# EAGLE design htr_reg (EAGLE 9.0.1)
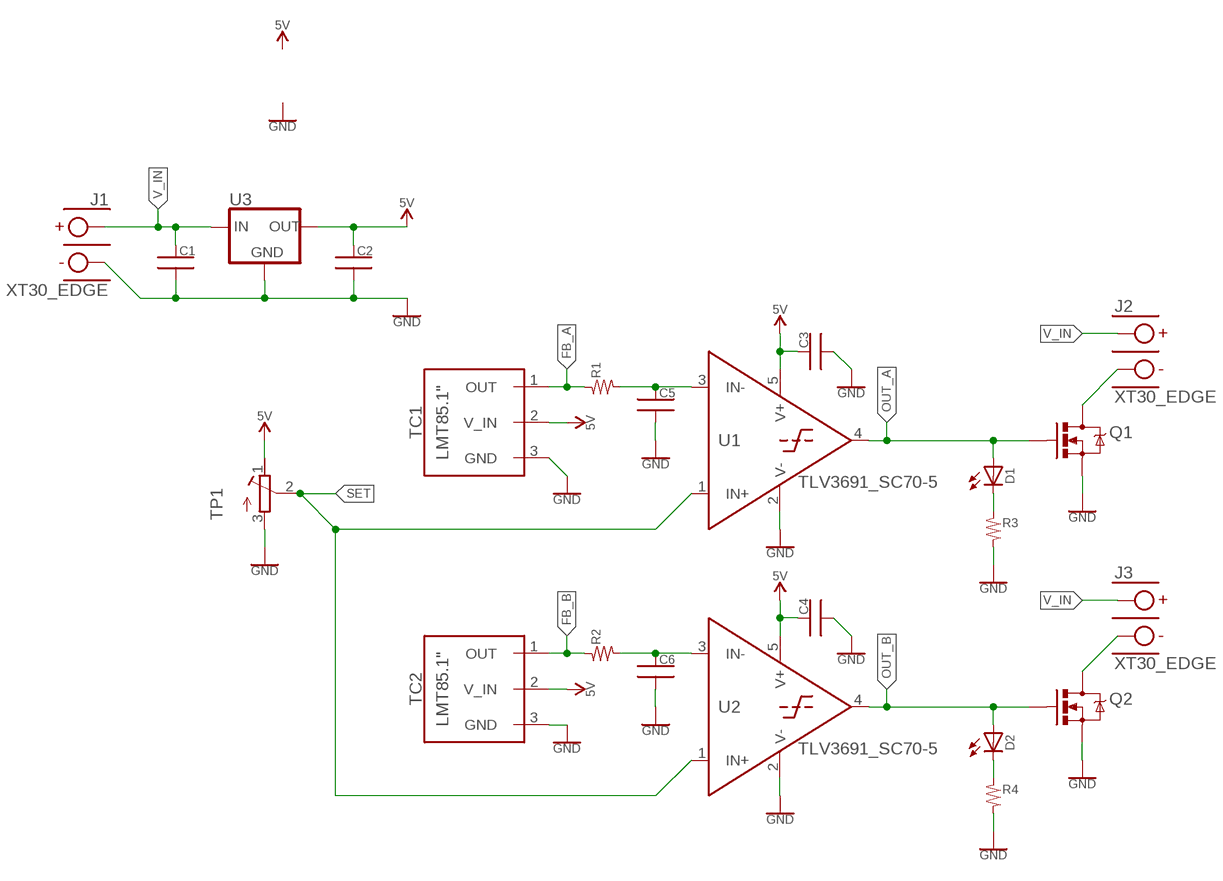
[diagram p0: schematic, sheet 1]

## Parts
C1  CAP_SMD_0603  [0603]
C2  CAP_SMD_0603  [0603]
C3  CAP_SMD_0603  [0603]
C4  CAP_SMD_0603  [0603]
C5  CAP_SMD_0603  [0603]
C6  CAP_SMD_0603  [0603]
D1  LED0603  [LED-0603]
D2  LED0603  [LED-0603]
J1  XT30_EDGE  [XT30_EDGEMOUNT]
J2  XT30_EDGE  [XT30_EDGEMOUNT]
J3  XT30_EDGE  [XT30_EDGEMOUNT]
Q1  MOSFET_N-CHANNEL_SOT23-3  [SOT23-3]
Q2  MOSFET_N-CHANNEL_SOT23-3  [SOT23-3]
R1  RES_SMD0603  [0603]
R2  RES_SMD0603  [0603]
R3  RES_SMD0603  [0603]
R4  RES_SMD0603  [0603]
TC1  LMT85.1"  [1X03]
TC2  LMT85.1"  [1X03]
TP1  3296W  [3296W]
U1  TLV3691_SC70-5  [SC70-5]
U2  TLV3691_SC70-5  [SC70-5]
U3  78XX_VREG_B  [SOT23-3]

## Nets
5V: C2.1 C3.1 C4.1 TC1.2(V_IN) TC2.2(V_IN) TP1.1(E) U1.5(V+) U2.5(V+) U3.2(OUT)
FB_A: R1.1 TC1.1(OUT)
FB_B: R2.1 TC2.1(OUT)
GND: C1.2 C2.2 C3.2 C4.2 C5.2 C6.2 J1.NEG Q1.2(S) Q2.2(S) R3.2 R4.2 TC1.3(GND) TC2.3(GND) TP1.3(A) U1.2(V-) U2.2(V-) U3.1(GND)
N$2: D1.C R3.1
N$4: D2.C R4.1
N$5: J3.NEG Q2.3(D)
N$6: J2.NEG Q1.3(D)
N$7: C6.1 R2.2 U2.3(IN-)
N$9: C5.1 R1.2 U1.3(IN-)
OUT_A: D1.A Q1.1(G) U1.4(OUT)
OUT_B: D2.A Q2.1(G) U2.4(OUT)
SET: TP1.2(S) U1.1(IN+) U2.1(IN+)
V_IN: C1.1 J1.POS J2.POS J3.POS U3.3(IN)

## Library data of the parts
C1-C6 = htr_reg_lib:CAP_SMD
D1 D2 = htr_reg_lib:LED
J1-J3 = htr_reg_lib:XT30
Q1 Q2 = htr_reg_lib:MOSFET_N-CHANNEL
R1-R4 = htr_reg_lib:RES_SMD
TC1 TC2 = htr_reg_lib:LMT85: LMT85 Analog Temperature Sensor -50C to 150C, 1.8V-5.5V Vin Texas Instruments http://www.ti.com/lit/ds/symlink/lmt85.pdf
TP1 = htr_reg_lib:3296: Bourns Trimpot 3296
U1 U2 = htr_reg_lib:TLV3691: generic comparator, .9 to 6.5v, 24us response, pushpull output. http://www.ti.com/lit/ds/symlink/tlv3691.pdf
U3 = htr_reg_lib:78XX_VREG: Generic IGO 78XX linear voltage regulator

## Board
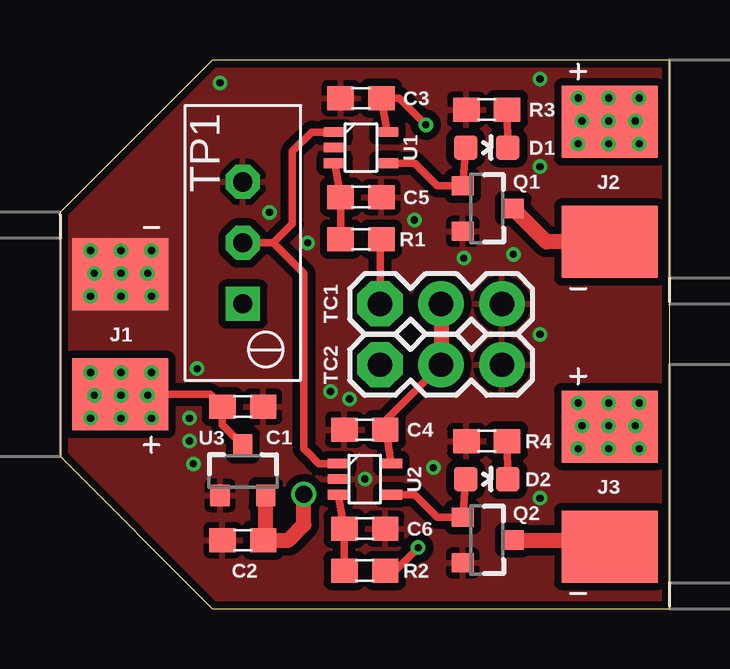
[diagram p1: board, top side]
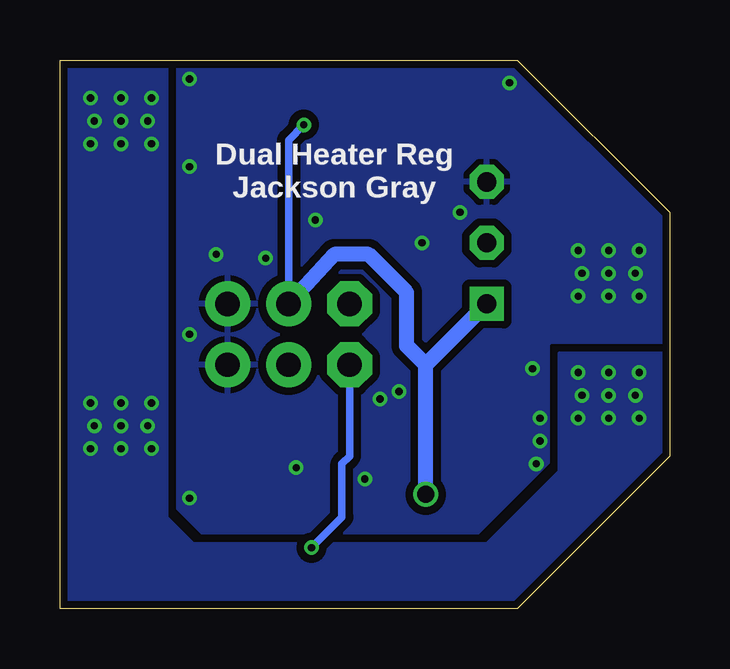
[diagram p2: board, bottom side, seen from below]

Size 25.4 x 22.86 mm. Coordinates in mm from the lower left corner, seen from the top.
Outline: 0,16.51 0,6.35 6.35,0 25.4,0 25.4,22.86 6.35,22.86 0,16.51
Copper layers (1*16): Top 0.035mm / dielectric 1.5mm / Bottom 0.035mm
Design rules "3PCB_2layer *": minimum track width 6mil, minimum drill 0.3mm, track to track 6mil, track to pad 6mil, pad to pad 6mil, via to via 6mil, smd to smd 6mil, copper to edge 6mil, drill to drill 6mil, minimum pad ring 6mil, minimum via ring 6mil, stop-mask expansion 2mil, vias tented up to drill 4mm, thermal gap 10mil

### Footprints (pad centres in the part's own frame; a part is rotated, then mirrored left to right if it is on the bottom)
0603 = smd 1.1 x 1: 1 -0.85,0; 2 0.85,0
LED-0603 = smd 1 x 1: A 0,-0.877; C 0,0.877
XT30_EDGEMOUNT = smd 4 x 3: NEG -2.5,-2.5; POS -2.5,2.5
SOT23-3 = smd 0.8 x 0.9: 1 -0.95,-1; 2 0.95,-1; 3 0,1.1
1X03 = drill 1.016 pad 1.88 octagon: 1 0,0 | drill 1.016 pad 1.88: 2 2.54,0; 3 5.08,0
3296W = drill 0.8 pad 1.422 square: 1 0,-2.54 | drill 0.8 pad 1.422 octagon: 2 0,0; 3 0,2.54
SC70-5 = smd 0.9 x 0.4: 1 -1.1,0.65; 2 -1.1,0; 3 -1.1,-0.65; 4 1.1,-0.65; 5 1.1,0.65

### Placement (x,y rotation side)
C1  7.62,8.41 0 top
C2  7.62,2.86 180 top
C3  12.54,21.27 180 top
C4  12.7,7.46 180 top
C5  12.54,17.14 0 top
C6  12.7,3.33 0 top
D1  17.78,19.21 270 top
D2  17.78,5.4 270 top
J1  0,11.43 180 top
J2  25.4,17.78 0 top
J3  25.4,5.08 0 top
Q1  17.78,16.67 270 top
Q2  17.78,2.86 270 top
R1  12.54,15.4 180 top
R2  12.7,1.59 180 top
R3  17.78,20.8 180 top
R4  17.78,6.99 180 top
TC1  13.34,12.7 0 top
TC2  13.34,10.16 0 top
TP1  7.62,15.24 0 top
U1  12.54,19.21 0 top
U2  12.7,5.4 0 top
U3  7.62,5.71 0 top

### Tracks (layer width: path | path; a pad name or v marks a point on that pad's centre or on a via)
5V  (via drill 0.3, 0.7)
  Top 0.318: C2.1 8.57,2.96 | TC2.2 13.55,7.83 13.55,7.62 | 13.55,7.62 C4.1 | U2.5 13.55,7.62 | U1.5 C3.1 14.13,21.27 v15.24,20.16
  Top 0.635: 8.57,2.96 U3.2 | TC1.2 TC2.2 | C2.1 9.53,2.86 10.16,3.49 v10.16,4.76
  Bottom 0.318: v15.24,20.16 15.88,19.53 TC1.2
  Bottom 0.635: 10.16,10.16 TP1.1 | v10.16,4.76 10.16,10.16 | 10.16,10.16 10.95,10.95 10.95,13.18 12.54,14.76 13.97,14.76 TC1.2
FB_A
  Top 0.318: TC1.1 13.34,14.92 R1.1
FB_B  (via drill 0.3)
  Top 0.318: v14.92,2.54 13.97,1.59 R2.1
  Bottom 0.318: v14.92,2.54 13.65,3.81 13.65,6.03 13.34,6.35 TC2.1
GND  (via drill 0.3)
  other vias: 10.32,15.24 8.73,16.51 14.76,16.19 16.83,14.61 11.27,9.05 12.06,8.73 5.4,7.94 5.71,10 5.56,6.03 5.4,6.99 1.27,14.92 1.27,13.02 2.54,13.02 3.81,13.02 3.81,14.92 2.54,14.92 2.54,13.97 1.43,13.97 3.65,13.97 6.67,21.91 15.56,5.87 12.7,5.4 20,22.07 20,18.41 18.89,14.76 20,11.43 20,4.6
  pour Top (isolate 0.318, rank 4): -2.54,-2.54 27.94,-2.54 27.94,25.4 -2.54,25.4
  pour Bottom (isolate 0.318, rank 4): -3.81,-3.81 29.21,-3.81 29.21,26.67 -3.81,26.67
N$2
  Top 0.318: R3.1 D1.C
N$4
  Top 0.318: R4.1 D2.C
N$5
  Top 0.635: Q2.3 22.62,2.86 J3.NEG
N$6
  Top 0.635: J2.NEG 20.27,15.28 Q1.3
N$7
  Top 0.318: R2.2 C6.1 U2.3
N$9
  Top 0.318: U1.3 C5.1 R1.2
OUT_A
  Top 0.318: D1.A Q1.1 15.72,17.62 14.78,18.56 U1.4
OUT_B
  Top 0.318: D2.A Q2.1 15.72,3.81 14.78,4.75 U2.4
SET
  Top 0.318: TP1.2 8.89,15.24 | 8.89,15.24 9.68,16.03 9.68,19.05 10.49,19.86 U1.1 | 8.89,15.24 10.16,13.97 10.16,6.67 10.32,6.51 10.78,6.05 U2.1
V_IN  (via drill 0.3)
  Top 0.152: J1.POS v1.27,9.84 | J3.POS v21.59,8.57 | J2.POS v21.59,21.27
  Top 0.318: J1.POS 6.25,8.93 C1.1 6.77,7.67 U3.3
  other vias: 22.86,20.32 24.13,6.67 2.54,8.89 1.43,8.89 1.27,7.94 2.54,7.94 3.81,7.94 3.81,9.84 3.65,8.89 2.54,9.84 22.86,7.62 21.75,20.32 21.59,19.37 22.86,19.37 24.13,19.37 23.97,20.32 24.13,21.27 22.86,21.27 22.86,8.57 21.75,7.62 21.59,6.67 24.13,8.57 23.97,7.62 22.86,6.67
  pour Bottom (isolate 0.318, rank 2): 26.67,24.13 26.67,-1.27 5.08,-1.27 -1.27,5.08 -1.27,10.64 4.6,10.64 4.6,5.71 7.62,2.7 19.84,2.7 20.95,3.81 20.95,24.13

### Text on the board
bPlace: Dual Heater Reg / Jackson Gray